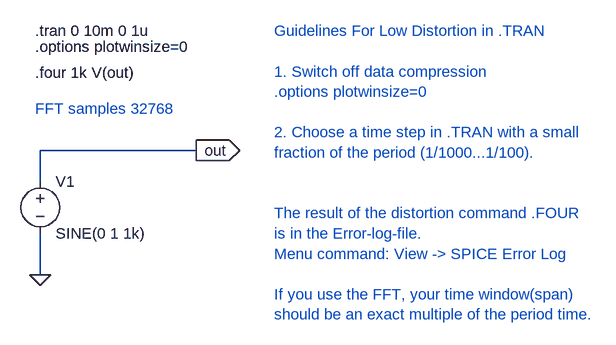
[diagram p0: schematic LowDistortionSine.asc]
LowDistortionSine.asc, the LTspice schematic file:
Version 4
SHEET 1 880 680
WIRE 160 112 -80 112
WIRE -80 160 -80 112
WIRE -80 304 -80 240
FLAG -80 304 0
FLAG 160 112 out
IOPIN 160 112 Out
SYMBOL voltage -80 144 R0
WINDOW 123 0 0 Left 0
WINDOW 39 0 0 Left 0
SYMATTR InstName V1
SYMATTR Value SINE(0 1 1k)
TEXT -88 -72 Left 0 !.tran 0 10m 0 1u
TEXT -88 -48 Left 0 !.options plotwinsize=0
TEXT -88 -8 Left 0 !.four 1k V(out)
TEXT 280 -72 Left 0 ;Guidelines For Low Distortion in .TRAN\n \n1. Switch off data compression\n.options plotwinsize=0\n \n2. Choose a time step in .TRAN with a small \nfraction of the period (1/1000...1/100).\n \n \nThe result of the distortion command .FOUR \nis in the Error-log-file.\nMenu command: View -> SPICE Error Log\n \nIf you use the FFT, your time window(span) \nshould be an exact multiple of the period time.
TEXT -88 48 Left 0 ;FFT samples 32768

The netlist it stands for:
* LowDistortionSine.asc
V1 out 0 SINE(0 1 1k)
.tran 0 10m 0 1u
.options plotwinsize=0
.four 1k V(out)
* Guidelines For Low Distortion in .TRAN
* 1. Switch off data compression
* .options plotwinsize=0
* 2. Choose a time step in .TRAN with a small
* fraction of the period (1/1000...1/100).
* The result of the distortion command .FOUR
* is in the Error-log-file.
* Menu command: View -> SPICE Error Log
* If you use the FFT, your time window(span)
* should be an exact multiple of the period time.
* FFT samples 32768
.backanno
.end